# Altium schematic sheet 音柱配套电路.SchDoc
size A4
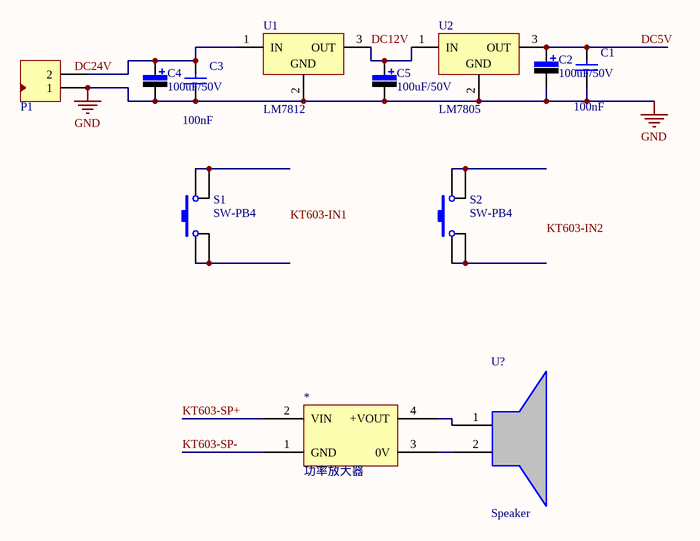
[diagram p0: 音柱配套电路.SchDoc]

## Parts
*  功率放大器
C1  value 100nF  [C-RAD]  (hidden comment: Cap)
C2  value 100uF/50V  [C-RB-SD6]  (hidden comment: Cap-Pol-ES)
C3  value 100nF  [C-RAD]  (hidden comment: Cap)
C4  value 100uF/50V  [C-RB-SD6]  (hidden comment: Cap-Pol-ES)
C5  value 100uF/50V  [C-RB-SD6]  (hidden comment: Cap-Pol-ES)
P1  Header 2  [HDR2X1-2.54]  (value not drawn)
S1  SW-PB4  [SW_PB4_A1]
S2  SW-PB4  [SW_PB4_A1]
U1  LM7812  [TO220-3]
U2  LM7805  [TO220-3]
U?  Speaker

## Nets
GND: C1.1 C2.2 C3.1 C4.2 C5.2 P1.1 U1.2(GND) U2.2(GND)
DC5V: C1.2 C2.1 U2.3(OUT)
DC12V: C5.1 U1.3(OUT) U2.1(IN)
KT603-SP+: *.2(VIN)
KT603-SP-: *.1(GND)
Net*_3: *.3(0V) U?.2
Net*_4: *.4(+VOUT) U?.1
NetC3_2: C3.2 C4.1 P1.2 U1.1(IN)
NetS1_1: S1.1 S1.4
NetS1_2: S1.2 S1.3
NetS2_1: S2.1 S2.4
NetS2_2: S2.2 S2.3

## Notes on the sheet
- Labels drawn without touching a wire or pin: DC24V, KT603-IN1, KT603-IN2

## Library data of the parts
* = b0505-1wr2
C1 C3 = Cap-RAD: 插件瓷片电容; Published: 8-Jun-2000; LatestRevisionDate: 17-Jul-2002; LatestRevisionNote: Re-released for DXP Platform.; PackageReference: RAD-0.3; Publisher: Altium Limited
C2 C4 C5 = Cap-Pol-ES: 贴片铝电解电容; Published: 8-Jun-2000; LatestRevisionDate: 17-Jul-2002; LatestRevisionNote: Re-released for DXP Platform.; PackageReference: RB7.6-15; Publisher: Altium Limited
P1 = Header 2: 接插件; LatestRevisionDate: 17-Jul-2002; LatestRevisionNote: Re-released for DXP Platform.; Publisher: Altium Limited
S1 S2 = SW-PB4: 微动开关; Published: 24-Mar-1999; LatestRevisionDate: 17-Jul-2002; LatestRevisionNote: Re-released for DXP Platform.; PackageReference: SPST-2; Publisher: Altium Limited
U1 U2 = LM7805CT: Series 3-Terminal Positive Regulator